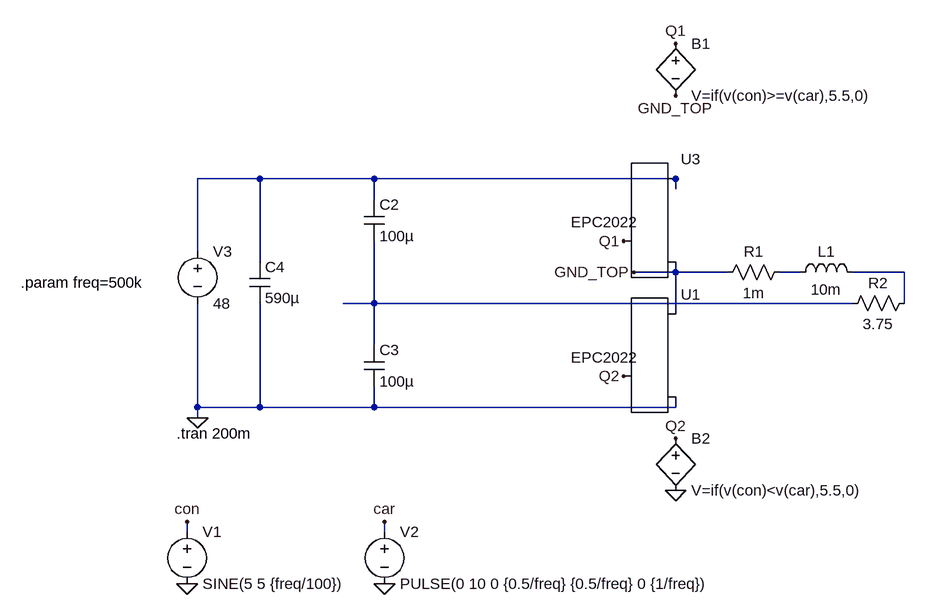
[diagram p0: schematic Halfbridge_EPC2022.asc]
Halfbridge_EPC2022.asc, the LTspice schematic file:
Version 4
SHEET 1 940 680
WIRE -1200 -80 -1296 -80
WIRE -1024 -80 -1200 -80
WIRE -560 -80 -1024 -80
WIRE -560 -64 -560 -80
WIRE -1024 -48 -1024 -80
WIRE -1296 32 -1296 -80
WIRE -1200 48 -1200 -80
WIRE -560 64 -560 48
WIRE -560 64 -624 64
WIRE -480 64 -560 64
WIRE -368 64 -400 64
WIRE -208 64 -288 64
WIRE -1024 112 -1024 16
WIRE -1024 112 -1072 112
WIRE -288 112 -1024 112
WIRE -208 112 -208 64
WIRE -560 128 -560 64
WIRE -1024 176 -1024 112
WIRE -1296 272 -1296 112
WIRE -1200 272 -1200 112
WIRE -1200 272 -1296 272
WIRE -1024 272 -1024 240
WIRE -1024 272 -1200 272
WIRE -560 272 -560 256
WIRE -560 272 -1024 272
WIRE -1296 288 -1296 272
WIRE -1312 464 -1312 448
WIRE -1008 464 -1008 448
FLAG -1312 448 con
FLAG -1008 448 car
FLAG -1312 544 0
FLAG -1008 544 0
FLAG -560 -288 Q1
FLAG -560 400 0
FLAG -560 320 Q2
FLAG -640 224 Q2
FLAG -1296 288 0
FLAG -560 -208 GND_TOP
FLAG -640 16 Q1
FLAG -624 64 GND_TOP
SYMBOL voltage -1312 448 R0
WINDOW 123 0 0 Left 0
WINDOW 39 0 0 Left 0
SYMATTR InstName V1
SYMATTR Value SINE(5 5 {freq/100})
SYMBOL voltage -1008 448 R0
WINDOW 123 0 0 Left 0
WINDOW 39 0 0 Left 0
SYMATTR InstName V2
SYMATTR Value PULSE(0 10 0 {0.5/freq} {0.5/freq} 0 {1/freq})
SYMBOL bv -560 -304 R0
SYMATTR InstName B1
SYMATTR Value V=if(v(con)>=v(car),5.5,0)
SYMBOL bv -560 304 R0
SYMATTR InstName B2
SYMATTR Value V=if(v(con)<v(car),5.5,0)
SYMBOL voltage -1296 16 R0
WINDOW 123 0 0 Left 0
WINDOW 39 0 0 Left 0
SYMATTR InstName V3
SYMATTR Value 48
SYMBOL cap -1040 -48 R0
SYMATTR InstName C2
SYMATTR Value 100µ
SYMBOL cap -1040 176 R0
SYMATTR InstName C3
SYMATTR Value 100µ
SYMBOL cap -1216 48 R0
SYMATTR InstName C4
SYMATTR Value 590µ
SYMBOL EPCGaN -640 16 R0
WINDOW 3 -81 -29 Left 2
SYMATTR Value EPC2022
SYMATTR InstName U3
SYMBOL EPCGaN -640 224 R0
WINDOW 3 -81 -29 Left 2
SYMATTR Value EPC2022
SYMATTR InstName U1
SYMBOL ind -384 80 R270
WINDOW 0 32 56 VTop 2
WINDOW 3 5 56 VBottom 2
SYMATTR InstName L1
SYMATTR Value 10m
SYMBOL res -384 48 R90
WINDOW 0 0 56 VBottom 2
WINDOW 3 32 56 VTop 2
SYMATTR InstName R1
SYMATTR Value 1m
SYMBOL res -192 96 R90
WINDOW 0 0 56 VBottom 2
WINDOW 3 32 56 VTop 2
SYMATTR InstName R2
SYMATTR Value 3.75
TEXT -1328 312 Left 2 !.tran 200m
TEXT -1568 80 Left 2 !.param freq=500k

The netlist it stands for:
* Halfbridge_EPC2022.asc
V1 con 0 SINE(5 5 {freq/100})
V2 car 0 PULSE(0 10 0 {0.5/freq} {0.5/freq} 0 {1/freq})
B1 Q1 GND_TOP V=if(v(con)>=v(car),5.5,0)
B2 Q2 0 V=if(v(con)<v(car),5.5,0)
V3 N001 0 48
C2 N001 N004 100µ
C3 N004 0 100µ
C4 N001 0 590µ
XU3 Q1 N001 GND_TOP EPC2022
XU1 Q2 GND_TOP 0 EPC2022
L1 N002 N003 10m
R1 N002 GND_TOP 1m
R2 N003 N004 3.75
.tran 200m
.param freq=500k
.backanno
.end